# EAGLE design haystack_mic (EAGLE 9.1.0)
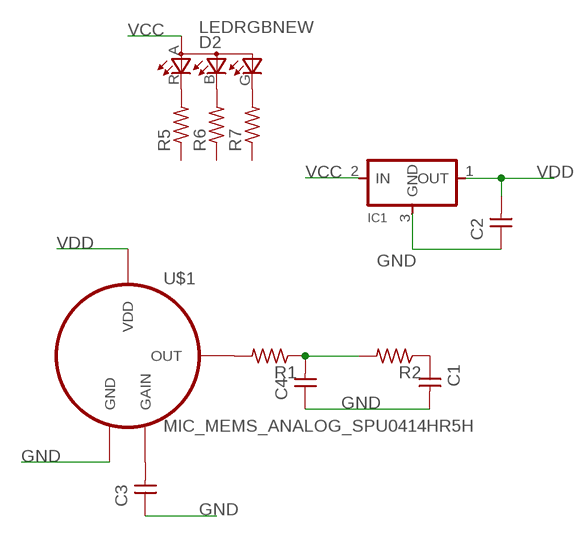
[diagram p0: schematic, sheet 1]

## Parts
C1  CAP-UNPOLARIZED  [C1206]
C2  CAP-UNPOLARIZED  [C1206]
C3  CAP-UNPOLARIZED  [C1206]
C4  CAP-UNPOLARIZED  [C1206]
D2  LEDRGBNEW  [P-LCC-4]
IC1  REGULATORSOT23  [SOT23]
R1  RES-US1206  [R1206]
R2  RES-US1206  [R1206]
R5  RES-US1206  [R1206]
R6  RES-US1206  [R1206]
R7  RES-US1206  [R1206]
U$1  MIC_MEMS_ANALOG_SPU0414HR5H  [MIC_MEMS_ANALOG_SPU0414HR5H]

## Nets
GND: C1.2 C2.1 C3.1 C4.1 IC1.3(GND) U$1.2(GND)
N$1: C1.1 R2.1
N$4: D2.R(CRED) R5.2
N$5: D2.B(CBLUE) R6.2
N$6: D2.G(CGREEN) R7.2
N$17: C3.2 U$1.3(GAIN)
N$18: R1.2 U$1.4(OUT)
N$19: C4.2 R1.1 R2.2
VCC: D2.A(A2) IC1.2(IN)
VDD: C2.2 IC1.1(OUT) U$1.1(VDD)
Unconnected: R5.1 R6.1 R7.1

## Library data of the parts
C1-C4 = fab :CAP-UNPOLARIZED
D2 = fab :LEDRGBNEW
IC1 = fab :REGULATOR
R1 R2 R5-R7 = fab :RES-US: Resistor (US Symbol) Variants with postfix FAB are widened to allow the routing of internal traces
U$1 = fab :MIC_MEMS_ANALOG_SPU0414HR5H

## Board
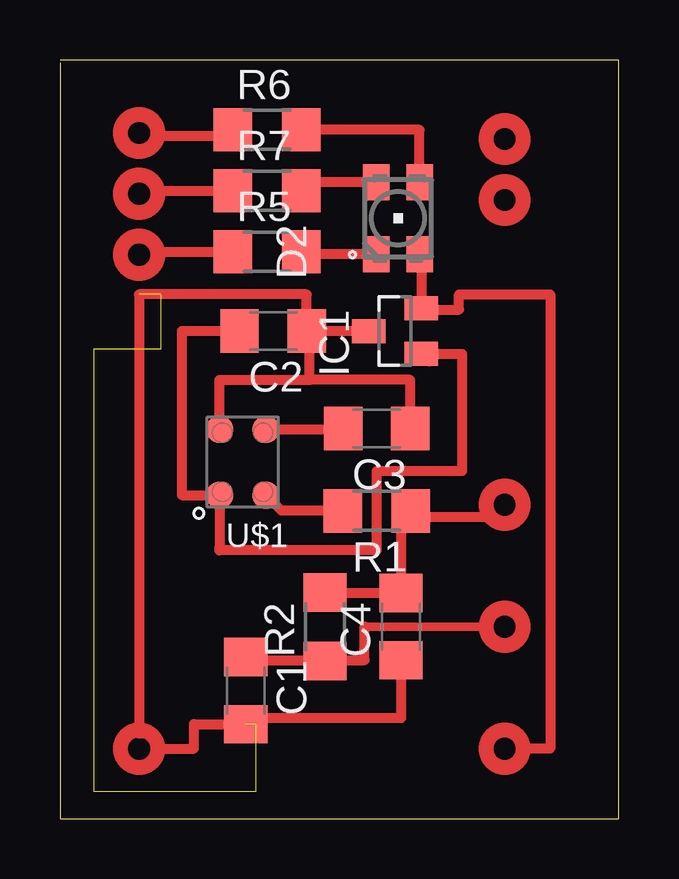
[diagram p1: board, top side]
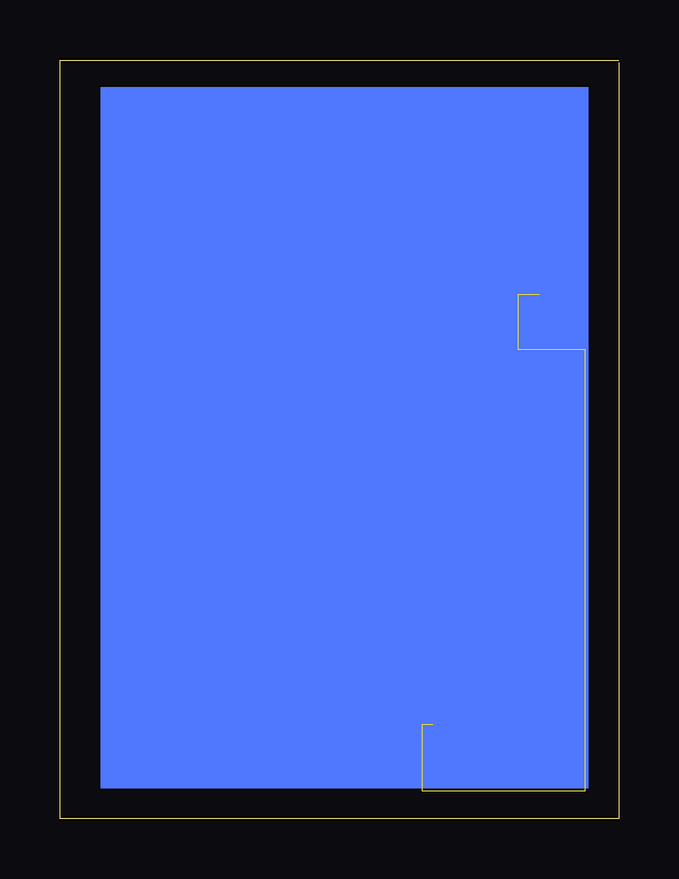
[diagram p2: board, bottom side, seen from below]

Size 23.29 x 31.61 mm. Coordinates in mm from the lower left corner, seen from the top.
Outline: 0,31.61 23.29,31.61 23.29,0 0,0 0,31.5
Copper layers (1*16): Top 0.035mm / dielectric 1.5mm / Bottom 0.035mm
Design rules "default": minimum track width 6mil, minimum drill 0.35mm, track to track 6mil, track to pad 6mil, pad to pad 6mil, via to via 6mil, smd to smd 6mil, copper to edge 40mil, drill to drill 6mil, minimum pad ring 10mil, minimum via ring 8mil, stop-mask expansion 4mil, vias tented up to drill 0mil, thermal gap 10mil

### Footprints (pad centres in the part's own frame; a part is rotated, then mirrored left to right if it is on the bottom)
C1206 = smd 1.6 x 1.8: 1 -1.4,0; 2 1.4,0
P-LCC-4 = smd 1.1 x 1.5: A 0.902,-1.5; B 0.902,1.5; G -0.902,1.5; R -0.902,-1.5
SOT23 = smd 1 x 1.4: 1 -0.95,-1.1; 2 0.95,-1.1; 3 0,1.1
R1206 = smd 1.6 x 1.803: 1 -1.422,0; 2 1.422,0
MIC_MEMS_ANALOG_SPU0414HR5H = smd 1.143 x 1.143: 1 0.965,1.372; 2 0.965,-1.372; 3 -0.965,-1.372; 4 -0.965,1.372

### Placement (x,y rotation side)
C1  7.75,5.33 270 top
C2  8.89,20.32 180 top
C3  13.21,16.26 180 top
C4  14.22,8 90 top
D2  14.1,25.02 0 top
IC1  13.97,20.32 90 top
R1  13.21,12.83 180 top
R2  11.05,8 90 top
R5  8.64,23.62 0 top
R6  8.64,28.7 0 top
R7  8.64,26.16 0 top
U$1  7.62,14.86 180 top

### Tracks (layer width: path | path; a pad name or v marks a point on that pad's centre or on a via)
GND  (7 unrouted)
  Top 0.406: IC1.3 C2.1 | U$1.2 6.66,18.29 10.41,18.29 | 10.41,18.29 10.41,20.32 C2.1 | C3.1 14.61,18.29 10.41,18.29 | C4.1 14.22,4.19 7.75,4.19 C1.2 | C2.1 10.29,21.84 3.3,21.84 3.3,3.56 3.43,3.56
N$1
  Top 0.406: R2.1 7.75,6.58 C1.1
N$2
  Top 0.406: 15.24,21.21 16.64,21.21 16.64,21.84 20.45,21.84 20.45,2.92 19.43,2.92
N$3
  Top 0.406: 14.35,12.57 17.91,12.57 17.91,12.7 | 17.91,12.83 17.91,12.7 | 17.91,12.7 17.78,12.7
N$4
  Top 0.406: D2.R 10.16,23.52 R5.2
N$5
  Top 0.406: D2.B 15,28.7 R6.2
N$6
  Top 0.406: D2.G 10.41,26.52 R7.2
N$7
  Top 0.406: 4.06,28.45 7.11,28.45 7.11,28.7
N$8
  Top 0.406: 4.06,25.91 4.06,26.16 7.62,26.16
N$9
  Top 0.406: 4.32,23.62 7.11,23.62
N$10
  Top 0.356: 12.7,8 17.78,8
  Top 0.406: 11.43,6.6 12.7,6.6 12.7,8
N$11
  Top 0.406: 4.19,2.92 5.59,2.92 5.59,3.94 7.62,3.94
N$17
  Top 0.406: U$1.3 11.78,16.23 C3.2
N$18
  Top 0.406: R1.2 11.79,12.85 9.22,12.85 U$1.4
N$19
  Top 0.406: R2.2 11.07,9.4 C4.2 14.22,12.83 R1.1
VCC
  Top 0.406: D2.A 15.07,22.85 IC1.2
VDD
  Top 0.406: C2.2 5.08,20.32 5.08,13.49 U$1.1 6.66,11.3 | 15.39,19.05 IC1.1 16.76,19.37 16.76,14.48 13.21,14.48 13.21,11.18 6.66,11.18 6.66,11.3 | 6.66,11.3 6.66,11.2
(copper drawn outside any net)
  shapes: Bottom area x1, Top circle x9